# EAGLE design alim (1) (EAGLE 6.4)
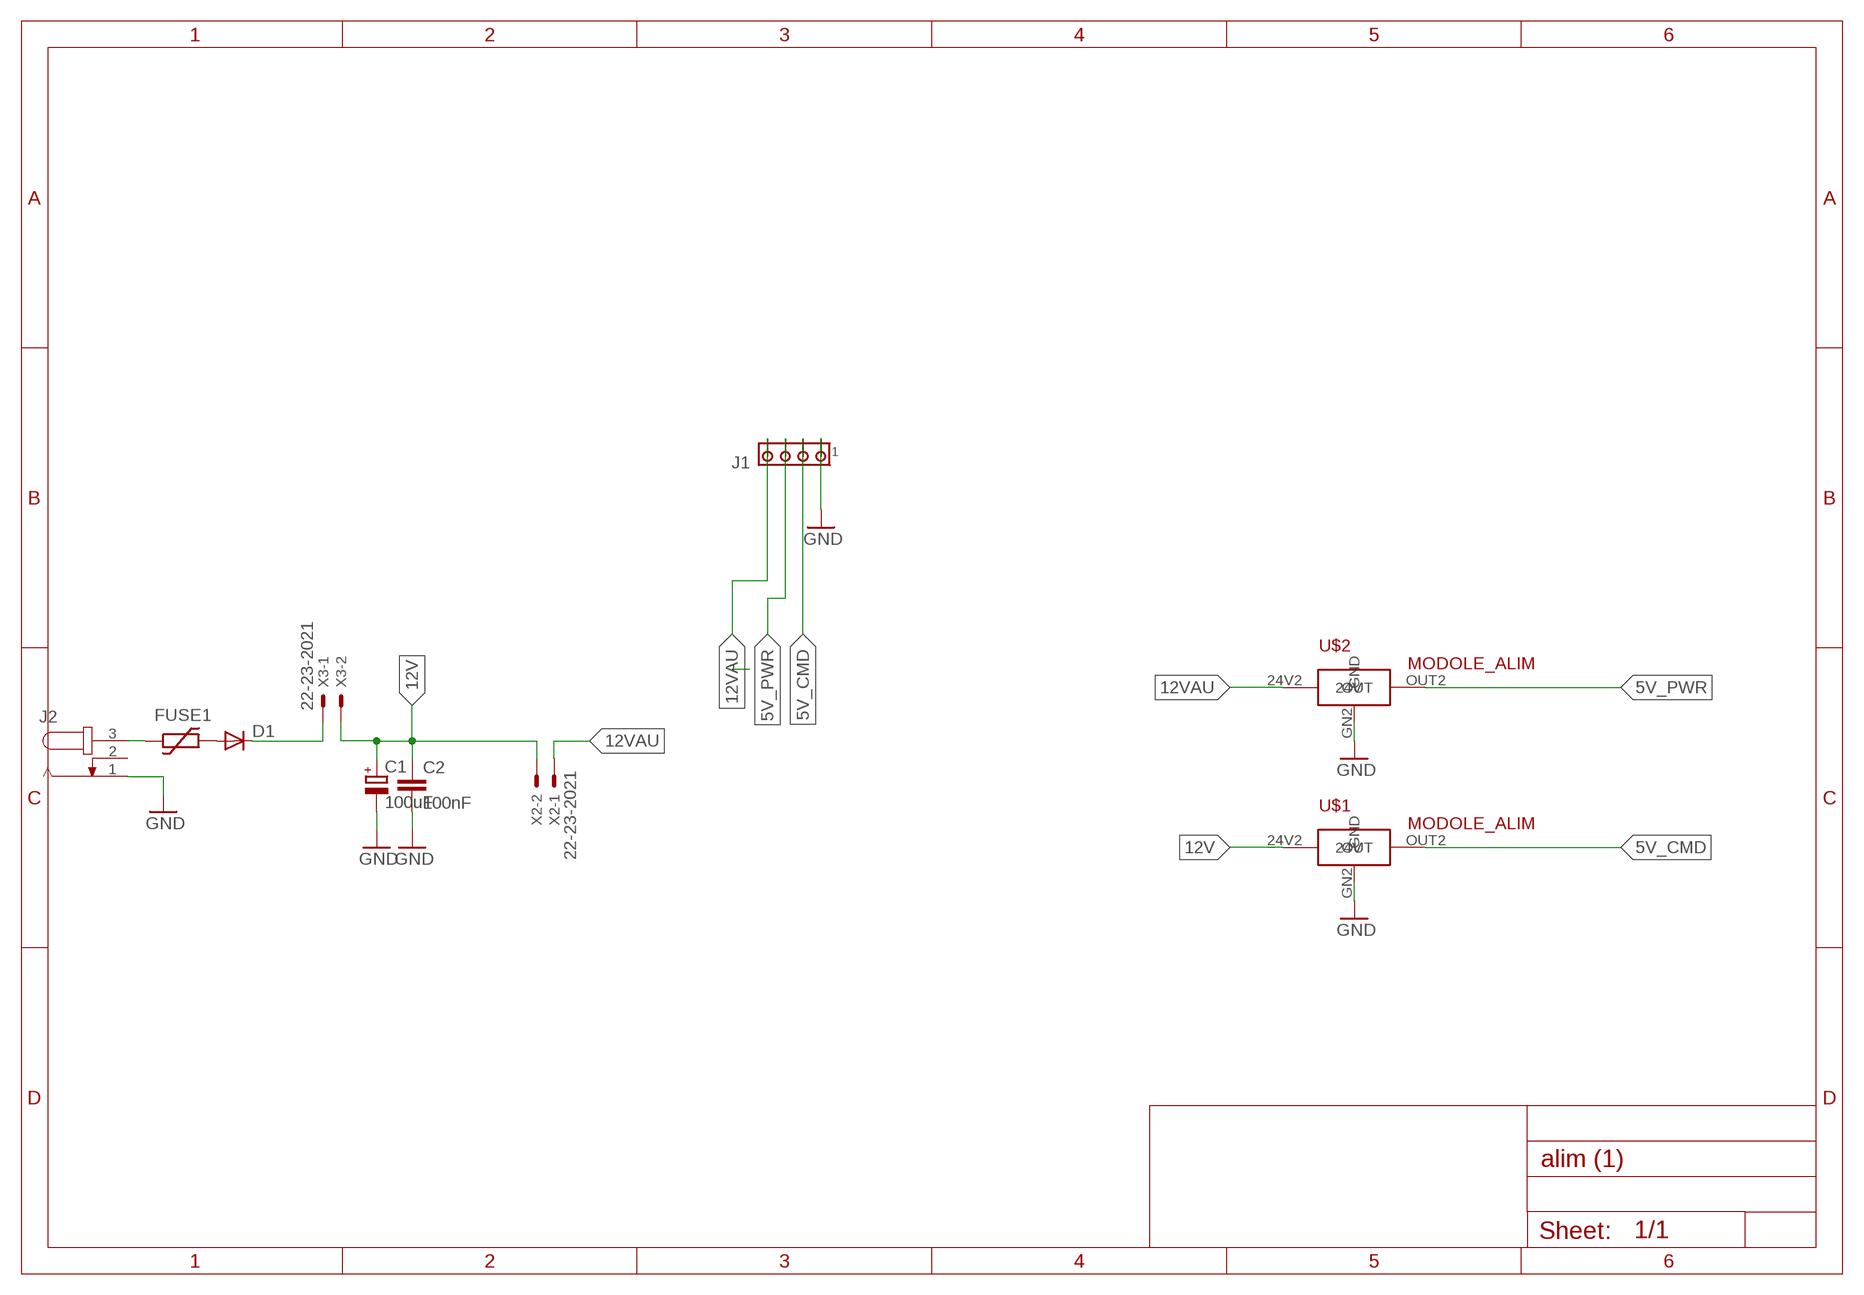
[diagram p0: schematic, sheet 1]

## Parts
C1  100uF  CPOL-EUE2.5-7  [E2,5-7]
C2  100nF  C-EU050-035X075  [C050-035X075]
D1  DIODE-DO07  [DO07]
FUSE1  MINI_SMD_C  [MINI_SMD_C]
J1  MTA04-100  [10X04MTA]
J2  JACK-PLUG1  [SPC4078]
U$1  MODOLE_ALIM  [PETITE_ALIM]
U$2  MODOLE_ALIM  [PETITE_ALIM]
X2  22-23-2021  [22-23-2021]
X3  22-23-2021  [22-23-2021]

## Nets
5V_CMD: J1.2 U$1.OUT2(OUT)
5V_PWR: J1.3 U$2.OUT2(OUT)
12V: C1.+ C2.1 U$1.24V2(24V) X2.2 X3.2
12VAU: J1.4 U$2.24V2(24V) X2.1
GND: C1.- C2.2 J1.1 J2.1 U$1.GN2(GND) U$2.GN2(GND)
N$1: D1.C X3.1
N$3: FUSE1.P$1 J2.3
N$5: D1.A FUSE1.P$2
Unconnected: J2.2

## Library data of the parts
C1 = resistor:CPOL-EU: POLARIZED CAPACITOR, European symbol
C2 = resistor:C-EU: CAPACITOR, European symbol
D1 = diode:DIODE-: DIODE
FUSE1 = polyswitch_smd-2:MINI_SMD_C: RAYCHEM Polyswitch family miniSMDC serie
J1 = con-amp:MTA04-100: AMP connector
J2 = con-jack:JACK-PLUG: DC POWER JACK Power Jack, DC, Right Angle, Through Hole, Rated 5A at 16VDC, PC Terminals Distributor: Farnell (www.Farnell.de) Drawing: 84N1161.pdf / 84N1162.pdf Manufacturer: SPC Technology (www.spctechnology.com) Type: SPC4077 / SPC 4078; OC_FARNELL: unknown; OC_NEWARK: unknown
U$1 U$2 = petite_alim:MODOLE_ALIM
X2 X3 = con-molex:22-23-2021: .100" (2.54mm) Center Header - 2 Pin; MF: MOLEX; MPN: 22-23-2021; OC_FARNELL: 1462926; OC_NEWARK: 25C3832

## Board
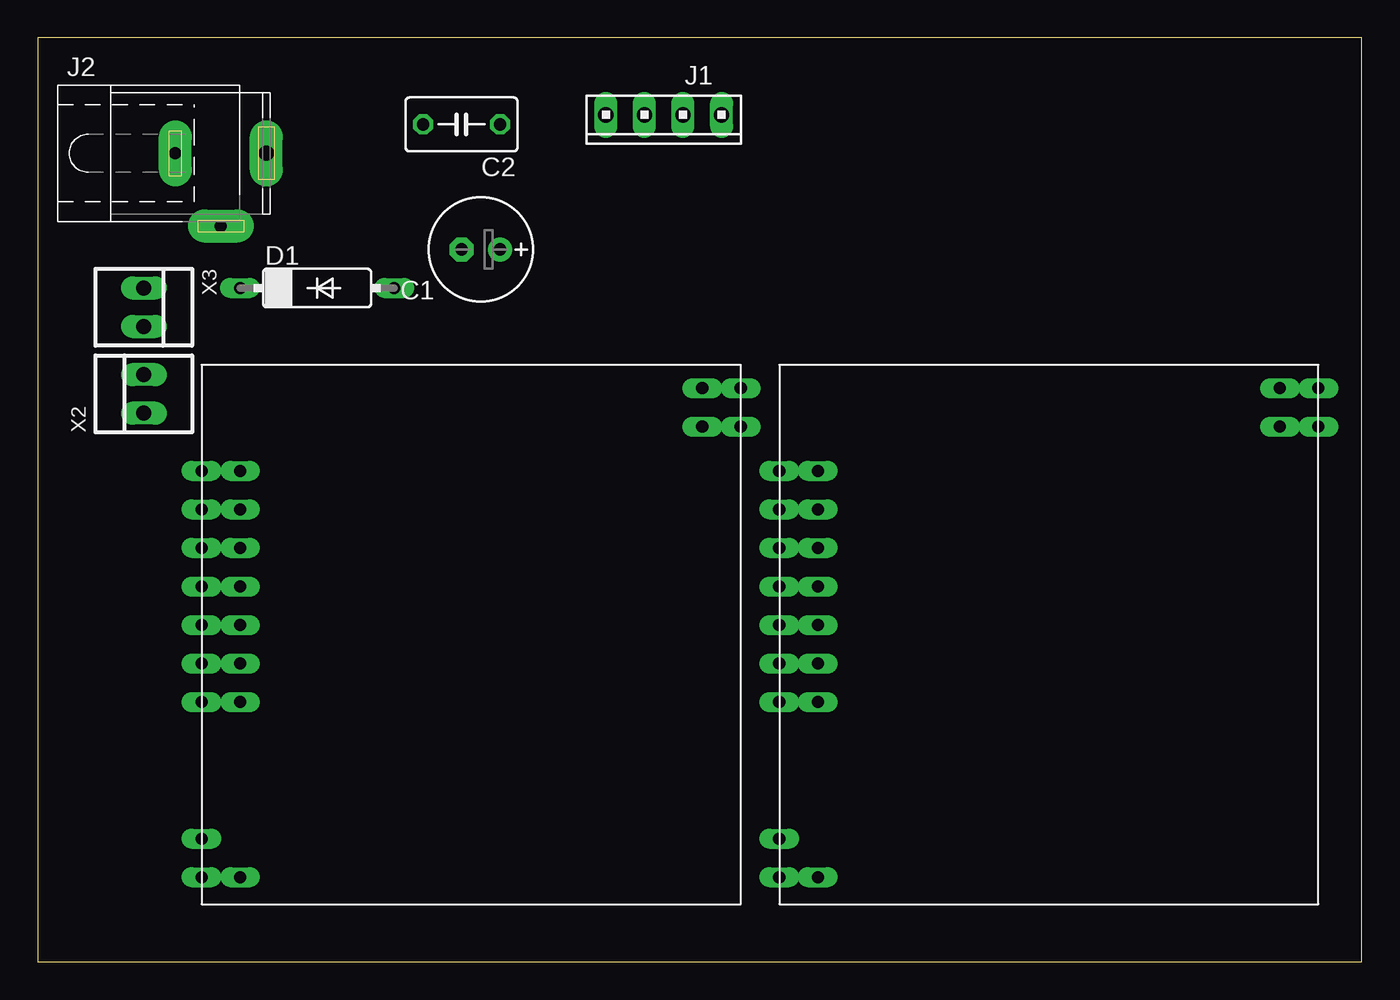
[diagram p1: board, top side]
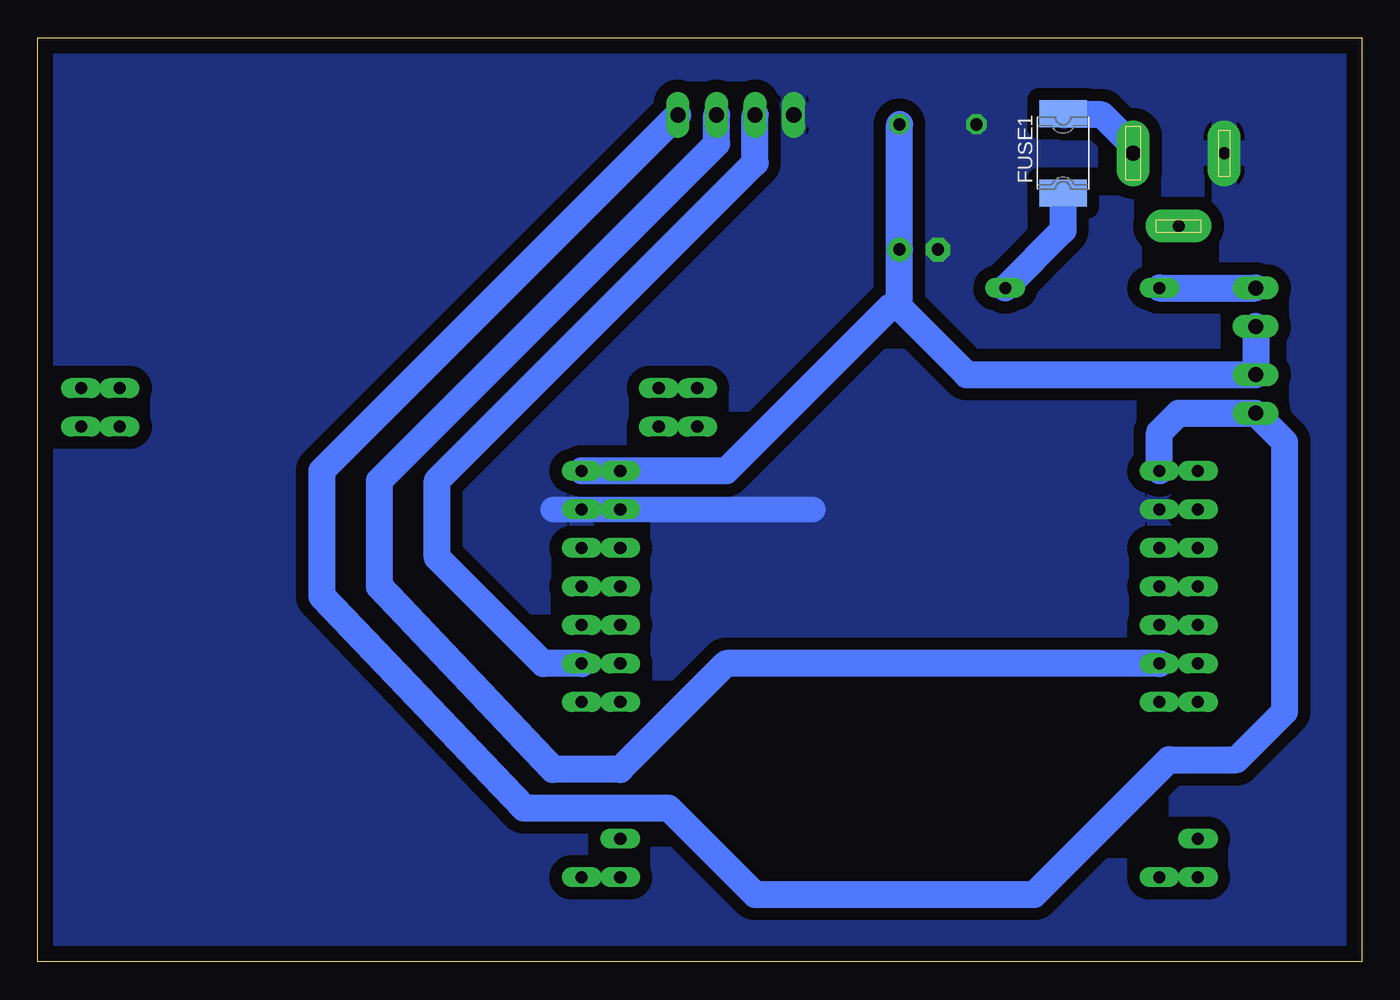
[diagram p2: board, bottom side, seen from below]

Size 87.3 x 60.95 mm. Coordinates in mm from the lower left corner, seen from the top.
Outline: 0,0 87.3,0 87.3,60.95 0,60.95 0,0
Copper layers (1*16): Top 0.035mm / dielectric 1.5mm / Bottom 0.035mm
Design rules "default": minimum track width 10mil, minimum drill 24mil, track to track 8mil, track to pad 8mil, pad to pad 8mil, via to via 8mil, smd to smd 8mil, copper to edge 40mil, drill to drill 8mil, minimum pad ring 10mil, minimum via ring 8mil, stop-mask expansion 4mil, vias tented up to drill 0mil, thermal gap 10mil

### Footprints (pad centres in the part's own frame; a part is rotated, then mirrored left to right if it is on the bottom)
E2,5-7 = drill 0.813 pad 1.6: + -1.27,0 | drill 0.813 pad 1.6 octagon: - 1.27,0
C050-035X075 = drill 0.813 octagon: 1 -2.54,0; 2 2.54,0
DO07 = drill 0.813 long: A 5.08,0; C -5.08,0
MINI_SMD_C = smd 1.78 x 3.15: P$1 2.615,0; P$2 -2.615,0
10X04MTA = drill 1.016 long: 1 3.81,0; 2 1.27,0; 3 -1.27,0; 4 -3.81,0
SPC4078 = drill 0.8 pad 2.184 long: 1 -3,0; 2 0,-4.8 | drill 1 pad 2.184 long: 3 3,0
PETITE_ALIM = drill 0.8 long: 1 -17.78,5.715; 2 -15.24,5.715; 24V1 -17.78,10.795; 24V2 -15.24,10.795; GN1 -17.78,8.255; GN2 -15.24,8.255; OUT1 -17.78,-1.905; OUT2 -15.24,-1.905; P$1 -17.78,-16.002; P$2 -15.24,-4.445; P$3 -17.78,-4.445; P$6 -15.24,0.635; P$7 -17.78,0.635; P$8 -17.78,3.175; P$9 -15.24,3.175; P$14 -15.24,-16.002; P$15 -17.78,-13.462; P$16 17.78,16.256; P$17 15.24,16.256; P$18 17.78,16.256; P$19 17.78,13.716; P$20 15.24,13.716
22-23-2021 = drill 1 long: 1 -1.27,0; 2 1.27,0

### Placement (x,y rotation side)
C1  29.21,46.99 180 top
C2  27.94,55.25 180 top
D1  18.41,44.45 0 top
FUSE1  19.68,53.34 90 bottom
J1  41.27,55.88 180 top
J2  12.06,53.34 0 top
U$1  66.67,21.59 0 top
U$2  28.57,21.59 0 top
X2  6.99,37.47 90 top
X3  6.99,43.18 270 top

### Tracks (layer width: path | path; a pad name or v marks a point on that pad's centre or on a via)
5V_CMD
  Bottom 1.778: U$1.OUT2 53.98,19.68 60.96,26.67 60.96,31.75 40.01,52.71 J1.2
5V_PWR
  Bottom 1.778: U$2.OUT2 41.91,19.68 48.9,12.7 53.34,12.7 64.77,24.77 64.77,31.75 42.55,53.98 J1.3
12V
  Bottom 1.778: X3.2 X2.2 26.04,38.74 30.48,43.18 | C2.1 C1.+ 30.48,43.18 | 30.48,43.18 31.11,43.18 41.91,32.38 U$1.24V2
12VAU
  Bottom 1.778: U$2.24V2 13.34,34.93 12.06,36.2 X2.1 5.08,34.29 5.08,16.51 8.26,13.33 12.7,13.33 21.59,4.45 40.01,4.45 45.72,10.16 55.24,10.16 68.58,24.13 68.58,32.38 J1.4
GND
  Bottom 1.676: 53.34,29.84 36.2,29.84
  pour Bottom (isolate 0.813): 0,-0.64 87.63,-0.64 87.63,60.96 0,60.96
N$1
  Bottom 1.778: D1.C X3.1
N$3
  Bottom 1.778: J2.3 15.06,53.8 17.14,55.88 19.61,55.88 FUSE1.P$1
N$5
  Bottom 1.778: FUSE1.P$2 19.68,48.26 D1.A